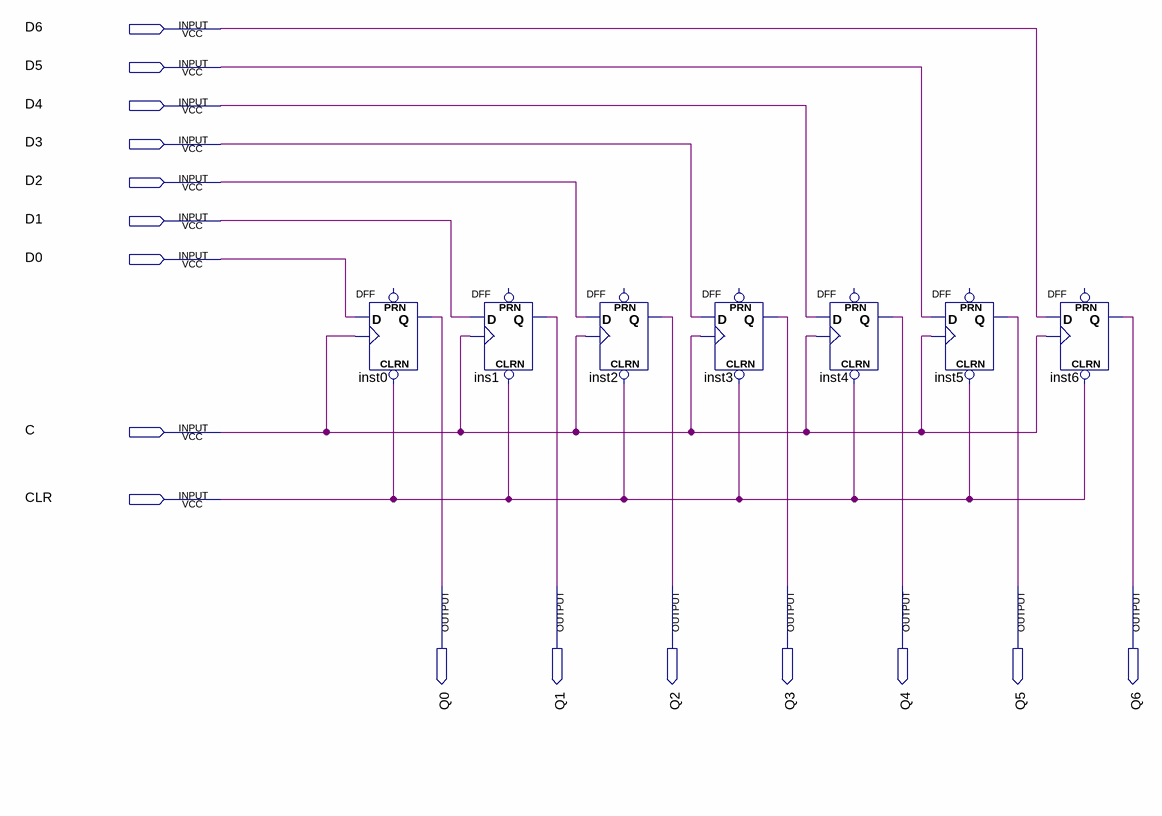
[diagram p0: schematic sheet]
// Quartus schematic sifo_lab1.bdf as structural Verilog: 7 symbols, 16 pins
module sifo_lab1 (
  input  D6,
  input  D5,
  input  D4,
  input  D3,
  input  D2,
  input  D1,
  input  D0,
  input  C,
  input  CLR,
  output Q0,
  output Q1,
  output Q2,
  output Q3,
  output Q4,
  output Q5,
  output Q6
);

  DFF inst0 (.CLRN(CLR), .CLK(C), .D(D0), .Q(Q0));  // open: PRN
  DFF ins1 (.CLRN(CLR), .CLK(C), .D(D1), .Q(Q1));  // open: PRN
  DFF inst2 (.CLRN(CLR), .CLK(C), .D(D2), .Q(Q2));  // open: PRN
  DFF inst3 (.CLRN(CLR), .CLK(C), .D(D3), .Q(Q3));  // open: PRN
  DFF inst4 (.CLRN(CLR), .CLK(C), .D(D4), .Q(Q4));  // open: PRN
  DFF inst5 (.CLRN(CLR), .CLK(C), .D(D5), .Q(Q5));  // open: PRN
  DFF inst6 (.CLRN(CLR), .CLK(C), .D(D6), .Q(Q6));  // open: PRN
endmodule
